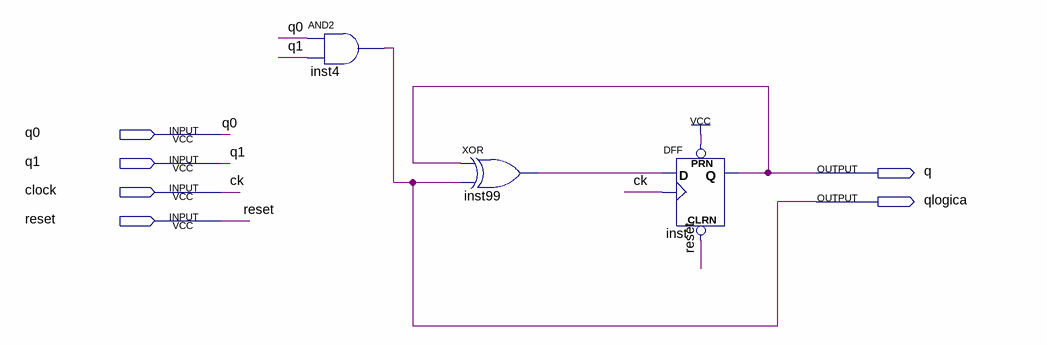
[diagram p0: schematic sheet]
// Quartus schematic abk_up_counter_intermed.bdf as structural Verilog: 3 symbols, 6 pins
module abk_up_counter_intermed (
  input  q0,
  input  q1,
  input  clock,
  input  reset,
  output q,
  output qlogica
);

  wire inst99_out;

  and inst4 (qlogica, q0, q1);
  xor inst99 (inst99_out, q, qlogica);
  DFF inst (.CLRN(reset), .CLK(clock), .D(inst99_out), .PRN(1'b1), .Q(q));

  // Other names for the same wires on the sheet: ck = clock
endmodule
